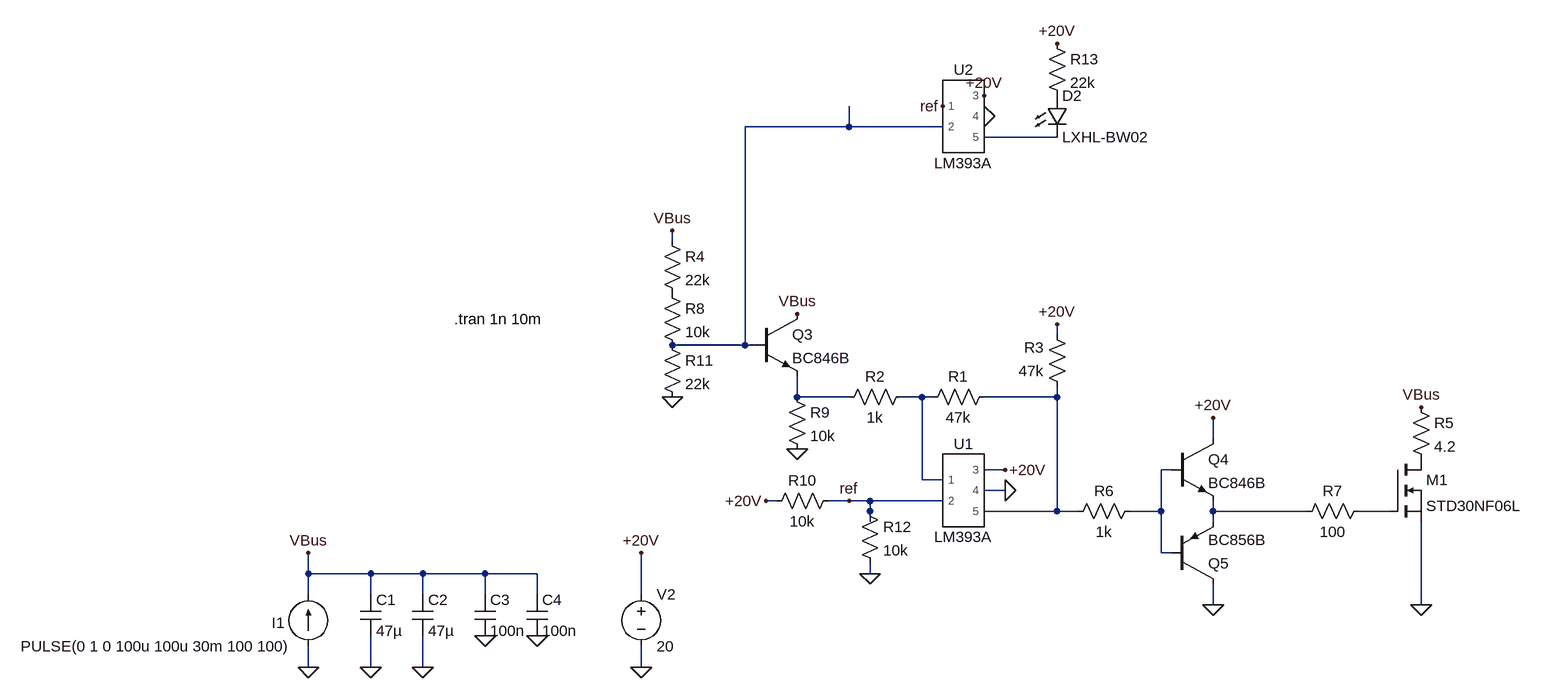
[diagram p0: schematic spice_model.asc]
spice_model.asc, the LTspice schematic file:
Version 4
SHEET 1 1912 884
WIRE 32 -128 32 -160
WIRE 32 -128 -128 -128
WIRE 176 -128 32 -128
WIRE 352 -112 240 -112
WIRE -240 48 -240 32
WIRE 352 192 352 176
WIRE -128 208 -128 -128
WIRE -128 208 -240 208
WIRE -112 208 -128 208
WIRE -48 288 -48 256
WIRE 32 288 -48 288
WIRE 144 288 112 288
WIRE 160 288 144 288
WIRE 352 288 352 272
WIRE 352 288 240 288
WIRE 592 352 592 320
WIRE 272 400 240 400
WIRE 528 400 512 400
WIRE 144 416 144 288
WIRE 176 416 144 416
WIRE 272 432 240 432
WIRE -80 448 -96 448
WIRE 32 448 0 448
WIRE 64 448 32 448
WIRE 176 448 64 448
WIRE 64 464 64 448
WIRE 352 464 352 288
WIRE 352 464 240 464
WIRE 384 464 352 464
WIRE 512 464 512 400
WIRE 512 464 464 464
WIRE 592 464 592 448
WIRE 736 464 592 464
WIRE 864 464 816 464
WIRE 64 480 64 464
WIRE 592 480 592 464
WIRE 512 528 512 464
WIRE 528 528 512 528
WIRE -800 560 -800 528
WIRE -704 560 -800 560
WIRE -624 560 -704 560
WIRE -528 560 -624 560
WIRE -448 560 -528 560
WIRE 64 560 64 544
WIRE -800 592 -800 560
WIRE -704 592 -704 560
WIRE -624 592 -624 560
WIRE -528 592 -528 560
WIRE -448 592 -448 560
WIRE -288 592 -288 528
WIRE 592 608 592 576
WIRE 912 608 912 480
WIRE -800 704 -800 672
WIRE -704 704 -704 656
WIRE -624 704 -624 656
WIRE -288 704 -288 672
FLAG -288 704 0
FLAG -288 528 +20V
FLAG 272 400 +20V
FLAG 272 432 0
FLAG 352 176 +20V
FLAG -800 704 0
FLAG -704 704 0
FLAG 912 608 0
FLAG 912 304 VBus
FLAG 592 320 +20V
FLAG -624 704 0
FLAG 64 560 0
FLAG -96 448 +20V
FLAG -48 160 VBus
FLAG 592 608 0
FLAG -800 528 VBus
FLAG -240 288 0
FLAG -48 368 0
FLAG -240 32 VBus
FLAG -528 656 0
FLAG -448 656 0
FLAG 240 -176 +20V
FLAG 240 -144 0
FLAG 352 -256 +20V
FLAG 32 448 ref
FLAG 176 -160 ref
SYMBOL voltage -288 576 R0
SYMATTR InstName V2
SYMATTR Value 20
SYMBOL AutoGenerated/LM393A 208 432 R0
SYMATTR InstName U1
SYMBOL Res 368 288 R180
WINDOW 0 36 76 Left 2
WINDOW 3 36 40 Left 2
SYMATTR InstName R3
SYMATTR Value 47k
SYMBOL current -800 672 R180
WINDOW 0 36 36 Left 2
WINDOW 3 24 0 Left 2
SYMATTR InstName I1
SYMATTR Value PULSE(0 1 0 100u 100u 30m 100 100)
SYMBOL Cap -720 592 R0
SYMATTR InstName C1
SYMATTR Value 47µ
SYMATTR SpiceLine Rser=28m
SYMBOL nmos 864 384 R0
SYMATTR InstName M1
SYMATTR Value STD30NF06L
SYMBOL Res 896 288 R0
SYMATTR InstName R5
SYMATTR Value 4.2
SYMBOL Res 256 272 R90
WINDOW 0 0 56 VBottom 2
WINDOW 3 32 56 VTop 2
SYMATTR InstName R1
SYMATTR Value 47k
SYMBOL Res 480 448 R90
WINDOW 0 0 56 VBottom 2
WINDOW 3 32 56 VTop 2
SYMATTR InstName R6
SYMATTR Value 1k
SYMBOL Res 832 448 R90
WINDOW 0 0 56 VBottom 2
WINDOW 3 32 56 VTop 2
SYMATTR InstName R7
SYMATTR Value 100
SYMBOL Cap -640 592 R0
SYMATTR InstName C2
SYMATTR Value 47µ
SYMATTR SpiceLine Rser=28m
SYMBOL Res -96 464 R270
WINDOW 0 32 56 VTop 2
WINDOW 3 0 56 VBottom 2
SYMATTR InstName R10
SYMATTR Value 10k
SYMBOL Res 128 272 R90
WINDOW 0 0 56 VBottom 2
WINDOW 3 32 56 VTop 2
SYMATTR InstName R2
SYMATTR Value 1k
SYMBOL Res -256 32 R0
SYMATTR InstName R4
SYMATTR Value 22k
SYMBOL Res -256 112 R0
SYMATTR InstName R8
SYMATTR Value 10k
SYMBOL Res -256 192 R0
SYMATTR InstName R11
SYMATTR Value 22k
SYMBOL npn -112 160 R0
SYMATTR InstName Q3
SYMATTR Value BC846B
SYMBOL Res -64 272 R0
SYMATTR InstName R9
SYMATTR Value 10k
SYMBOL npn 528 352 R0
SYMATTR InstName Q4
SYMATTR Value BC846B
SYMBOL pnp 528 576 M180
SYMATTR InstName Q5
SYMATTR Value BC856B
SYMBOL Res 48 448 R0
SYMATTR InstName R12
SYMATTR Value 10k
SYMBOL cap -544 592 R0
SYMATTR InstName C3
SYMATTR Value 100n
SYMATTR SpiceLine Rser=1m
SYMBOL cap -464 592 R0
SYMATTR InstName C4
SYMATTR Value 100n
SYMATTR SpiceLine Rser=1m
SYMBOL AutoGenerated/LM393A 208 -144 R0
SYMATTR InstName U2
SYMBOL LED 336 -176 R0
SYMATTR InstName D2
SYMATTR Value LXHL-BW02
SYMBOL Res 336 -272 R0
SYMATTR InstName R13
SYMATTR Value 22k
TEXT -576 168 Left 2 !.tran 1n 10m

The netlist it stands for:
* spice_model.asc
V2 +20V 0 20
XU1 N004 ref +20V 0 N005 LM393A  ; pins 1 2 3 4 5
R3 N005 +20V 47k
I1 0 VBus PULSE(0 1 0 100u 100u 30m 100 100)
C1 VBus 0 47µ Rser=28m
M1 P001 N008 0 0 STD30NF06L
R5 VBus P001 4.2
R1 N005 N004 47k
R6 N006 N005 1k
R7 N008 N007 100
C2 VBus 0 47µ Rser=28m
R10 +20V ref 10k
R2 N004 N003 1k
R4 VBus P002 22k
R8 P002 N001 10k
R11 N001 0 22k
Q3 VBus N001 N003 0 BC846B
R9 N003 0 10k
Q4 +20V N006 N007 0 BC846B
Q5 0 N006 N007 0 BC856B
R12 ref 0 10k
C3 VBus 0 100n Rser=1m
C4 VBus 0 100n Rser=1m
XU2 ref N001 +20V 0 N002 LM393A  ; pins 1 2 3 4 5
D2 P003 N002 LXHL-BW02
R13 +20V P003 22k
.model D D
.lib standard.dio
.model NPN NPN
.model PNP PNP
.lib standard.bjt
.model NMOS NMOS
.model PMOS PMOS
.lib standard.mos
.tran 1n 10m
.lib /Users/gijsbruining/Downloads/LM393A.5_1
.backanno
.end